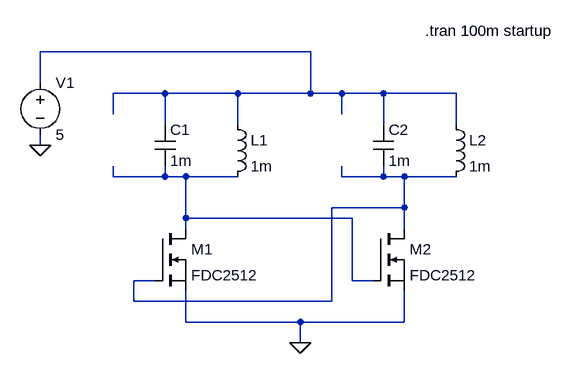
[diagram p0: schematic vco_attempt2.asc]
vco_attempt2.asc, the LTspice schematic file:
Version 4
SHEET 1 880 680
WIRE 416 64 0 64
WIRE 0 112 0 64
WIRE 192 128 112 128
WIRE 304 128 192 128
WIRE 416 128 416 64
WIRE 416 128 304 128
WIRE 464 128 416 128
WIRE 528 128 464 128
WIRE 640 128 528 128
WIRE 112 160 112 128
WIRE 464 160 464 128
WIRE 192 176 192 128
WIRE 304 176 304 128
WIRE 528 176 528 128
WIRE 640 176 640 128
WIRE 0 208 0 192
WIRE 112 256 112 240
WIRE 192 256 192 240
WIRE 192 256 112 256
WIRE 224 256 192 256
WIRE 304 256 224 256
WIRE 464 256 464 240
WIRE 528 256 528 240
WIRE 528 256 464 256
WIRE 560 256 528 256
WIRE 640 256 560 256
WIRE 560 304 560 256
WIRE 560 304 448 304
WIRE 224 320 224 256
WIRE 480 320 224 320
WIRE 224 336 224 320
WIRE 560 336 560 304
WIRE 176 416 144 416
WIRE 480 416 480 320
WIRE 512 416 480 416
WIRE 144 448 144 416
WIRE 448 448 448 304
WIRE 448 448 144 448
WIRE 224 480 224 432
WIRE 400 480 224 480
WIRE 560 480 560 432
WIRE 560 480 400 480
WIRE 400 512 400 480
FLAG 400 512 0
FLAG 0 208 0
SYMBOL cap 176 176 R0
SYMATTR InstName C1
SYMATTR Value 1m
SYMBOL ind 288 160 R0
SYMATTR InstName L1
SYMATTR Value 1m
SYMBOL nmos 176 336 R0
SYMATTR InstName M1
SYMATTR Value FDC2512
SYMBOL cap 512 176 R0
SYMATTR InstName C2
SYMATTR Value 1m
SYMBOL ind 624 160 R0
SYMATTR InstName L2
SYMATTR Value 1m
SYMBOL nmos 512 336 R0
SYMATTR InstName M2
SYMATTR Value FDC2512
SYMBOL voltage 0 96 R0
SYMATTR InstName V1
SYMATTR Value 5
TEXT 592 32 Left 2 !.tran 100m startup

The netlist it stands for:
* vco_attempt2.asc
C1 N001 N002 1m
L1 N001 N002 1m
M1 N002 N003 0 0 FDC2512
C2 N001 N003 1m
L2 N001 N003 1m
M2 N003 N002 0 0 FDC2512
V1 N001 0 5
.model NMOS NMOS
.model PMOS PMOS
.lib standard.mos
.tran 100m startup
.backanno
.end